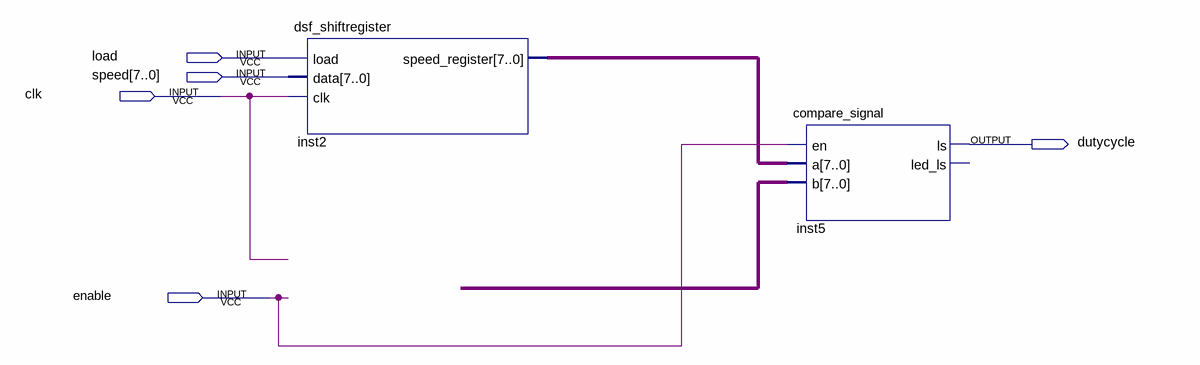
[diagram p0: schematic sheet]
// Quartus schematic pwm.bdf as structural Verilog: 2 symbols, 5 pins
module pwm (
  input  load,
  input  [7:0] speed,
  input  clk,
  input  enable,
  output dutycycle
);

  wire [7:0] inst2_speed_register, undriven;

  dsf_shiftregister inst2 (.load(load), .data(speed), .clk(clk), .speed_register(inst2_speed_register));
  compare_signal inst5 (.en(enable), .a(inst2_speed_register), .b(undriven), .ls(dutycycle));  // open: led_ls
endmodule
